# Altium schematic sheet Power.SchDoc
size A4; SheetNumber: 1; SheetTotal: 3
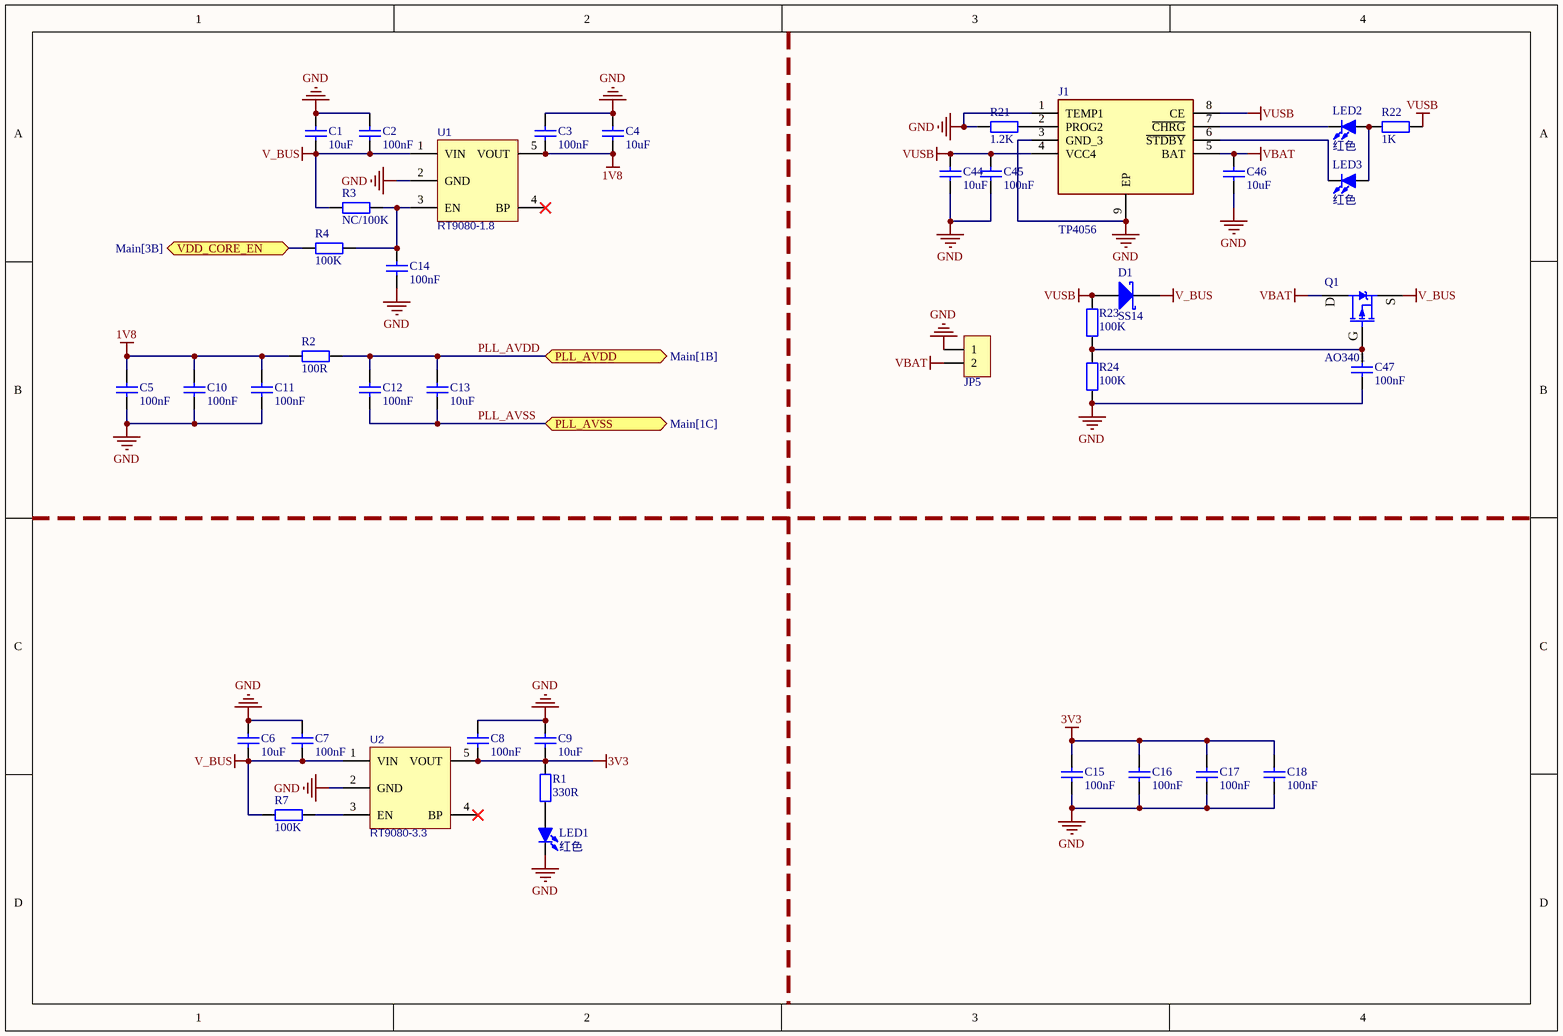
[diagram p0: Power.SchDoc]

## Parts
C1  10uF  [C0603_NS]
C2  100nF  [C0603_NS]
C3  100nF  [C0603_NS]
C4  10uF  [C0603_NS]
C5  100nF  [C0603_NS]
C6  10uF  [C0603_NS]
C7  100nF  [C0603_NS]
C8  100nF  [C0603_NS]
C9  10uF  [C0603_NS]
C10  100nF  [C0603_NS]
C11  100nF  [C0603_NS]
C12  100nF  [C0603_NS]
C13  10uF  [C0603_NS]
C14  100nF  [C0603_NS]
C15  100nF  [C0603_NS]
C16  100nF  [C0603_NS]
C17  100nF  [C0603_NS]
C18  100nF  [C0603_NS]
C44  10uF  [C0603_NS]
C45  100nF  [C0603_NS]
C46  10uF  [C0603_NS]
C47  100nF  [C0603_NS]
D1  SS14  [SMA]
J1  TP4056  [SOIC127P600X175-9N]
JP5  HDR-1X2  [XH2.54-LS-2P]  (value not drawn)
LED1  红色  [LED0603_R]
LED2  红色  [LED0603_R]
LED3  红色  [LED0603_R]
Q1  AO3401  [SOT23-3N]
R1  330R  [R0603_NS]
R2  100R  [R0603_NS]
R3  NC/100K  [R0603_NS]
R4  100K  [R0603_NS]
R7  100K  [R0603_NS]
R21  1.2K  [R0603_NS]
R22  1K  [R0603_NS]
R23  100K  [R0603_NS]
R24  100K  [R0603_NS]
U1  RT9080-1.8  [SOT-23-5]
U2  RT9080-3.3  [SOT-23-5]

## Ports
PLL_AVDD (bidir, see Main[1B]), PLL_AVSS (bidir, see Main[1C]), VDD_CORE_EN (bidir, see Main[3B])

## Nets
1V8: C3.1 C4.1 C5.2 C10.1 C11.2 R2.1 U1.5(VOUT)
3V3: C8.1 C9.1 C15.2 C16.2 C17.2 C18.2 R1.1 U2.5(VOUT)
GND: C1.2 C2.2 C3.2 C4.2 C5.1 C6.2 C7.2 C8.2 C9.2 C10.2 C11.1 C14.1 C15.1 C16.1 C17.1 C18.1 C44.1 C45.1 C46.1 C47.1 J1.1(TEMP1) J1.3(GND_3) J1.9(EP) JP5.1 LED1.2(K) R21.1 R24.1 U1.2(GND) U2.2(GND)
V_BUS: C1.1 C2.1 C6.1 C7.1 D1.2(K) Q1.2(S) R3.1 R7.1 U1.1(VIN) U2.1(VIN)
VBAT: C46.2 J1.5(BAT) JP5.2 Q1.3(D)
VUSB: C44.2 C45.2 D1.1(A) J1.4(VCC4) J1.8(CE) R22.2 R23.2
PLL_AVDD: C12.2 C13.2 R2.2 ; port PLL_AVDD
PLL_AVSS: C12.1 C13.1 ; port PLL_AVSS
VDD_CORE_EN: R4.1 ; port VDD_CORE_EN
NetC14_2: C14.2 R3.2 R4.2 U1.3(EN)
NetC47_2: C47.2 Q1.1(G) R23.1 R24.2
NetJ1_2: J1.2(PROG2) R21.2
NetJ1_6: J1.6(~{STDBY}) LED3.2(K)
NetJ1_7: J1.7(~{CHRG}) LED2.2(K)
NetLED1_1: LED1.1(A) R1.2
NetLED2_1: LED2.1(A) LED3.1(A) R22.1
NetR7_2: R7.2 U2.3(EN)

Not connected (* = marked no-connect by the designer): U1 4(BP)*; U2 4(BP)*

## Library data of the parts
C1-C18 C44-C47 = C: 贴片电容/MLCC电容; BOM名称: 无极性贴片电容; 联系卖家，免费查找封装: 唯一出售店铺网址https://shop463601444.taobao.com
D1 = SS14: 肖特基二极管; 属性: 40V/1A; 以赠品形式获赠本封装库的买家，还可联系卖家免费指导AD软件使用: 封装库来自淘宝卖家ID：黄晶宝石; BOM名称: 肖特基二极管
J1 = TP4056: Connector; Manufacturer_Name: NanJing Top Power; Datasheet Link: https://dlnmh9ip6v2uc.cloudfront.net/datasheets/Prototyping/TP4056.pdf; Height: 1.75mm; Manufacturer_Part_Number: TP4056
JP5 = Header 2: 2P接插件; 联系卖家，免费查找封装: 唯一出售店铺网址https://shop463601444.taobao.com; 封装库来自淘宝卖家ID:黄晶宝石: 其他店铺购入均为盗版假冒封装库，请立即申请退款，本店现金奖励20~200元; BOM名称: 2P接插件
LED1-LED3 = LED-SMD: 贴片LED; 封装库来自淘宝卖家ID：黄晶宝石: 其他店铺购入均为盗版封装库，请立即申请退款，本店现金奖励20~200元; BOM名称: 贴片LED
Q1 = AO3401: P沟道 30V/4.2A; BOM名称: 场效应管; 8元以下特价购入的买家: 还可以联系卖家远程指导AD软件使用; 参数: P沟道 30V/4.2A
R1-R4 R7 R21-R24 = R: 贴片电阻; 联系卖家，免费查找封装: 唯一出售店铺网址https://shop463601444.taobao.com; BOM名称: 贴片电阻
U1 U2 = RT9193-18GB: LDO 1.8V/0.3A; 芯片厂商: RICHTEK; 封装库来自淘宝卖家ID：黄晶宝石: 其他店铺购入的买家，请立即申请退款，本店现金奖励20~1000元; BOM名称: RT9193-18GB